# EAGLE design SchematicTwoTone (EAGLE 9.6.0)
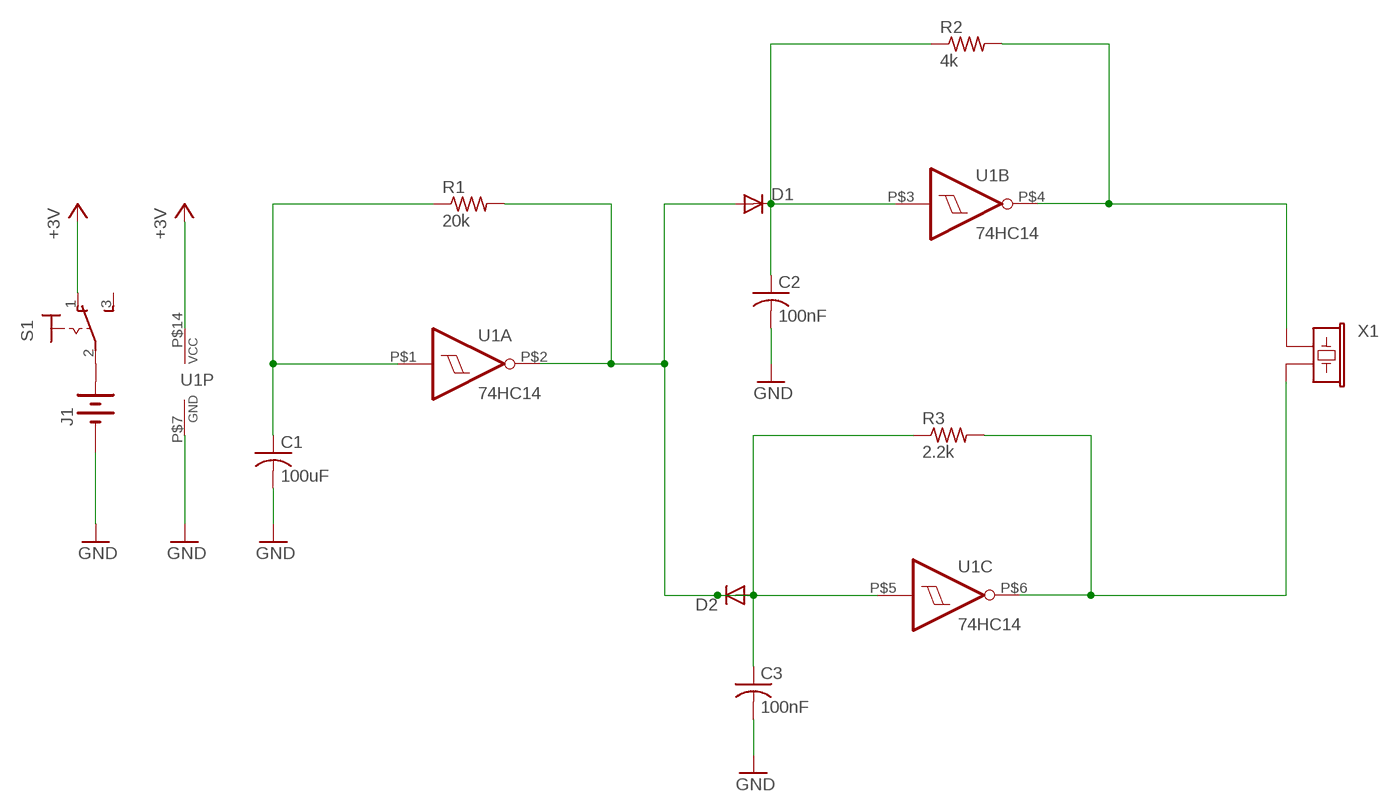
[diagram p0: schematic, sheet 1]

## Parts
C1  100uF  CAP-POLRB-D5.0XP2.0  [CAP-RB-P2.0-D5.0]
C2  100nF  CAP-POLRB-D5.0XP2.0  [CAP-RB-P2.0-D5.0]
C3  100nF  CAP-POLRB-D5.0XP2.0  [CAP-RB-P2.0-D5.0]
D1  DIODE-DO35DO35-P10.16  [DO35-P10.16]
D2  DIODE-DO35DO35-P7.62  [DO35-P7.62]
J1  BATTERY-3VBATT  [BATT-3V]
R1  20k  RESISTOR-AXIALHORIZONTAL  [AXIAL-P10.16]
R2  4k  RESISTOR-AXIALHORIZONTAL  [AXIAL-P10.16]
R3  2.2k  RESISTOR-AXIALHORIZONTAL  [AXIAL-P10.16]
S1  SWITCH-SPDT  [SS-12]
U1  74HC14  [DIP-14]
X1  BUZZER-PIEZOPS1720P02  [PS1720P02]

## Nets
+3V: S1.1(O) U1.P$14(P:VCC)
GND: C1.P$2 C2.P$2 C3.P$2 J1.P$2(-) U1.P$7(P:GND)
N$1: C1.P$1 R1.P$1 U1.P$1(A:I)
N$2: D1.A D2.A D2.K R1.P$2 U1.P$2(A:O)
N$3: C2.P$1 D1.K R2.P$1 U1.P$3(B:I)
N$4: R2.P$2 U1.P$4(B:O) X1.P$1
N$5: C3.P$1 R3.P$1 U1.P$5(C:I)
N$6: R3.P$2 U1.P$6(C:O) X1.P$2
N$7: J1.P$1(+) S1.2(P)
Unconnected: S1.3(S) U1.P$8(D:O) U1.P$9(D:I) U1.P$10(E:O) U1.P$11(E:I) U1.P$12(F:O) U1.P$13(F:I)

## Library data of the parts
C1-C3 = EGB240:CAP-POL: Capacitor, Radial, Polarised
D1 D2 = EGB240:DIODE-DO35: Diode, Axial, DO-35
J1 = EGB240:BATTERY-3V: Battery holder, 3V, 2xAA, flying leads
R1 R2 = EGB240:RESISTOR-AXIAL: Resistor, Axial, 0.25W
R3 = EGB240:RESISTOR-AXIAL: Resistor, Axial, 0.25W; SPICEPREFIX: R
S1 = EGB240:SWITCH-SPDT: Switch, SPDT, Slide, On-On
U1 = EGB240:74HC14: Hex schmitt trigger INVERTER
X1 = EGB240:BUZZER-PIEZO

## Board
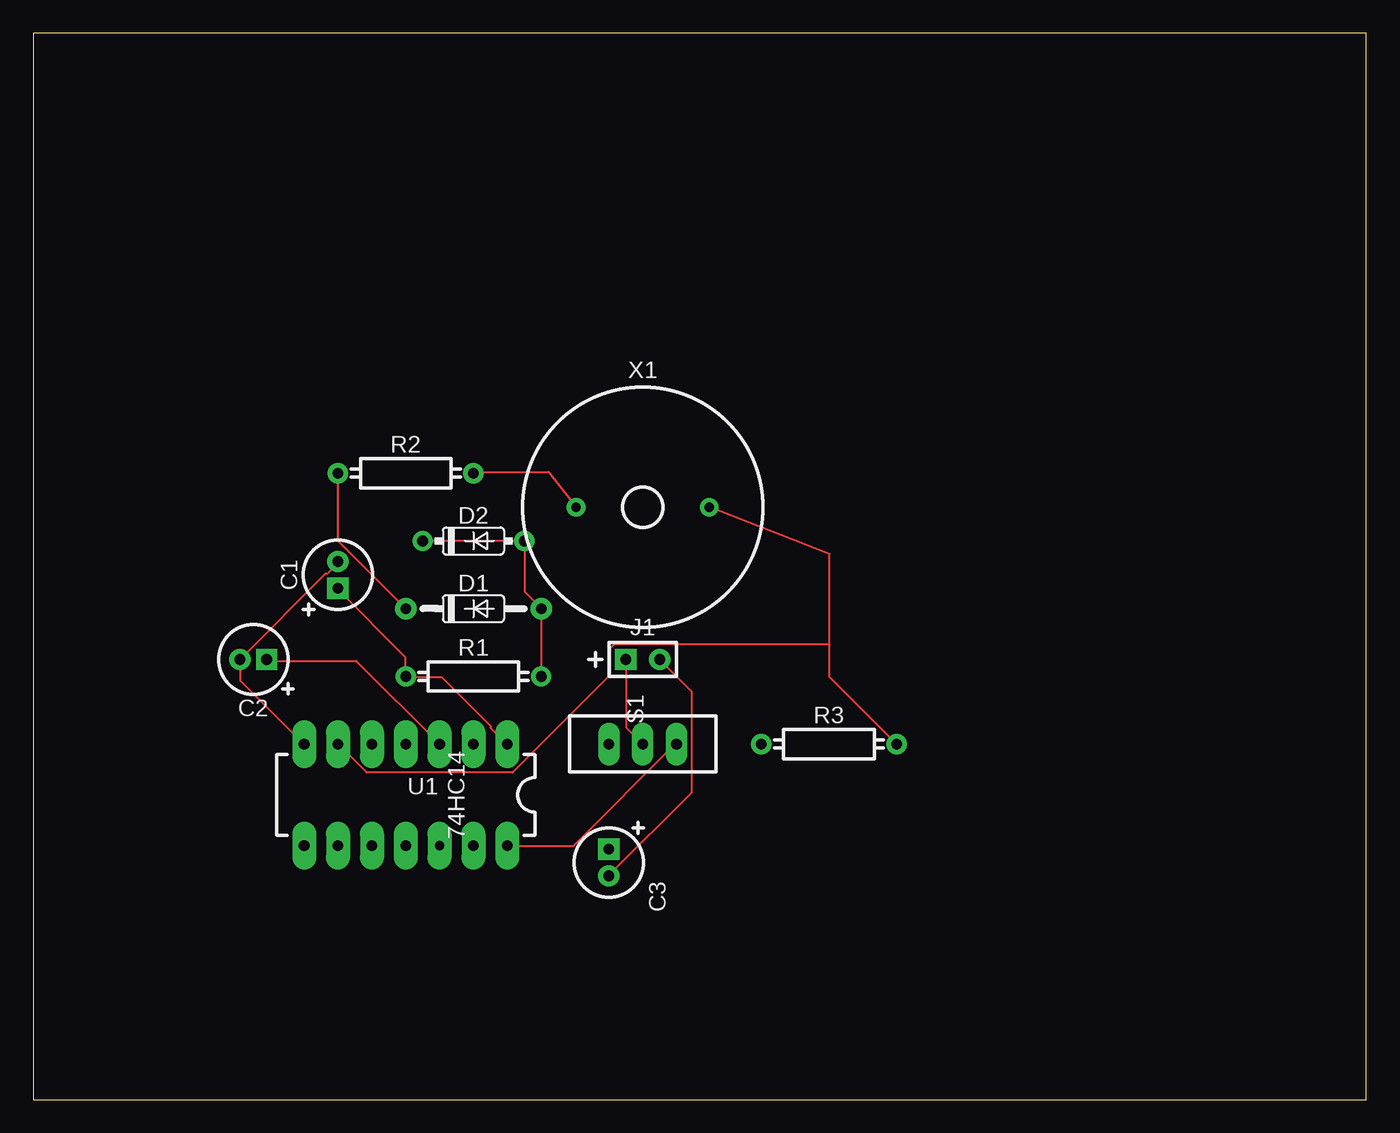
[diagram p1: board, top side]
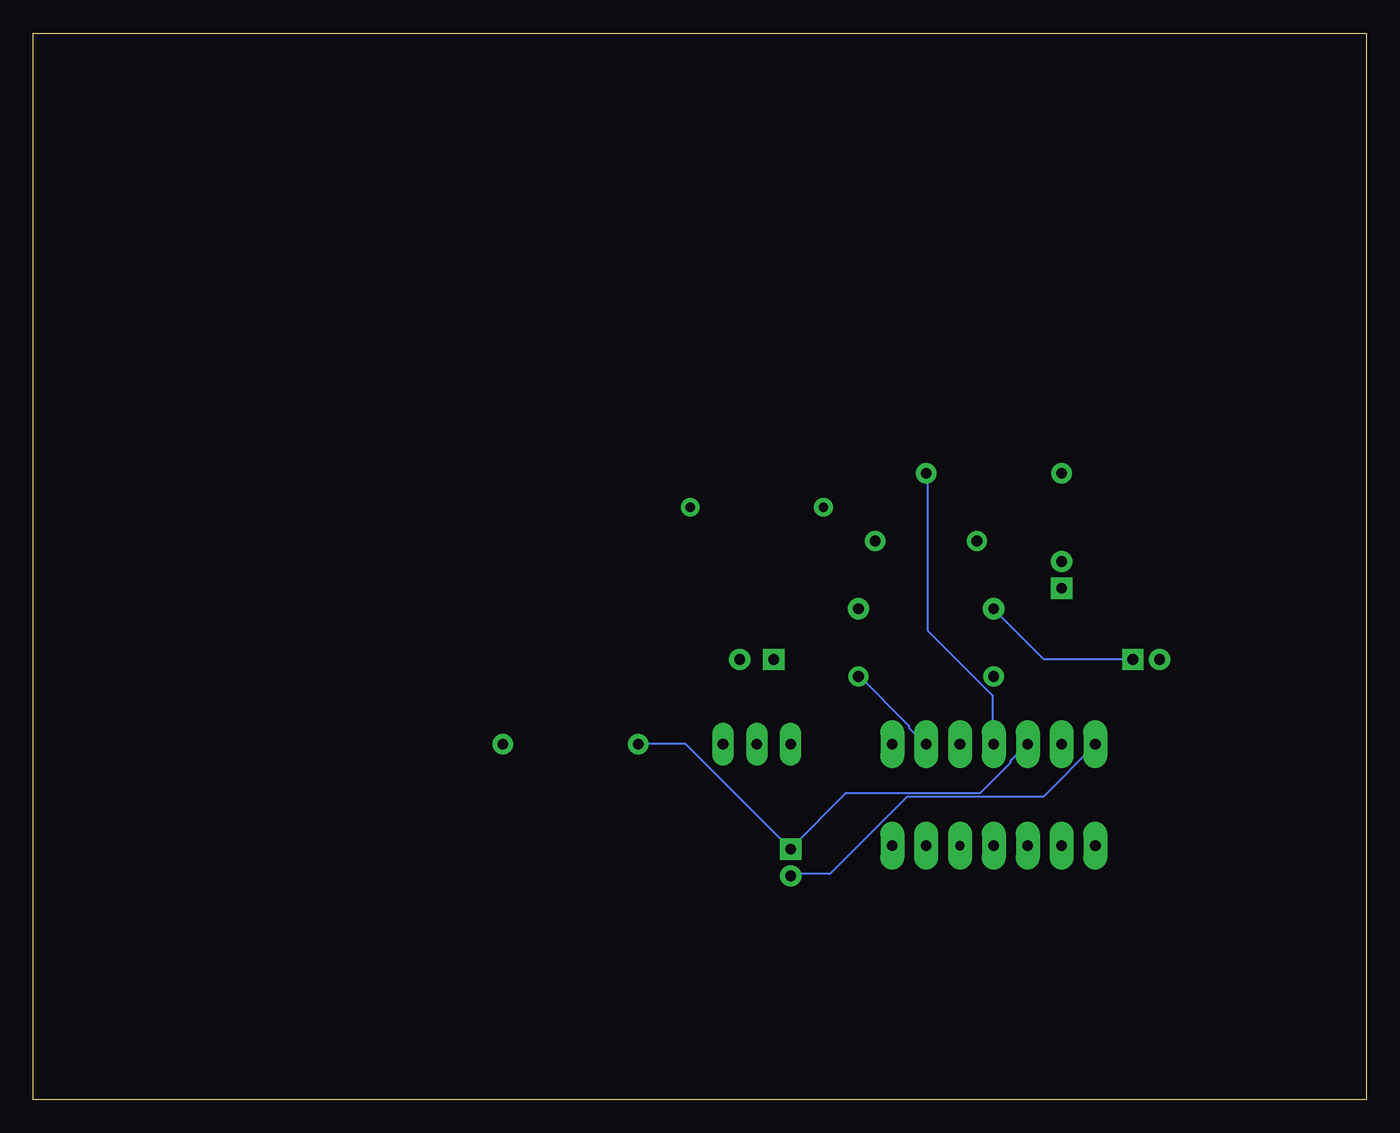
[diagram p2: board, bottom side, seen from below]

Size 100 x 80 mm. Coordinates in mm from the lower left corner, seen from the top.
Outline: 0,0 100,0 100,80 0,80 0,0
Copper layers (1*16): Top 0.035mm / dielectric 1.5mm / Bottom 0.035mm
Design rules "default": minimum track width 6mil, minimum drill 0.35mm, track to track 6mil, track to pad 6mil, pad to pad 6mil, via to via 6mil, smd to smd 6mil, copper to edge 40mil, drill to drill 6mil, minimum pad ring 10mil, minimum via ring 8mil, stop-mask expansion 4mil, vias tented up to drill 0mil, thermal gap 10mil

### Footprints (pad centres in the part's own frame; a part is rotated, then mirrored left to right if it is on the bottom)
CAP-RB-P2.0-D5.0 = drill 0.8 pad 1.6 square: P$1 -1,0 | drill 0.8 pad 1.6: P$2 1,0
DO35-P10.16 = drill 0.8 pad 1.6: A 5.08,0; K -5.08,0
DO35-P7.62 = drill 0.8 pad 1.524: A 3.81,0; K -3.81,0
BATT-3V = drill 0.8 pad 1.6 square: P$1 -1.27,0 | drill 0.8 pad 1.6: P$2 1.27,0
AXIAL-P10.16 = drill 0.8 pad 1.524: P$1 -5.08,0; P$2 5.08,0
SS-12 = drill 0.8 pad 1.6 long: 1 0,2.54; 2 0,0; 3 0,-2.54
DIP-14 = drill 0.8 pad 1.8 long: P$1 -3.81,7.62; P$2 -3.81,5.08; P$3 -3.81,2.54; P$4 -3.81,0; P$5 -3.81,-2.54; P$6 -3.81,-5.08; P$7 -3.81,-7.62; P$8 3.81,-7.62; P$9 3.81,-5.08; P$10 3.81,-2.54; P$11 3.81,0; P$13 3.81,5.08; P$14 3.81,7.62 | drill 0.7 pad 1.8 long: P$12 3.81,2.54
PS1720P02 = drill 0.7 pad 1.4: P$1 -5,0; P$2 5,0

### Placement (x,y rotation side)
C1  22.86,39.37 90 top
C2  16.51,33.02 180 top
C3  43.18,17.78 270 top
D1  33.02,36.83 0 top
D2  33.02,41.91 0 top
J1  45.72,33.02 0 top
R1  33.02,31.75 0 top
R2  27.94,46.99 0 top
R3  59.69,26.67 0 top
S1  45.72,26.67 270 top
U1  27.94,22.86 270 top
X1  45.72,44.45 0 top

### Tracks (layer width: path | path; a pad name or v marks a point on that pad's centre or on a via)
+3V
  Top 0.152: U1.P$14 40.54,19.05 48.16,26.67 S1.1
GND
  Top 0.152: J1.P$2 49.38,30.63 49.38,23.01 43.28,16.92 C3.P$2 | U1.P$7 20.27,26.67 15.54,31.39 15.54,32.92 C2.P$2 15.54,33.07 21.95,39.47 22.1,39.47 22.86,40.23 C1.P$2
  Bottom 0.152: C3.P$2 43.13,16.92 40.23,16.92 34.44,22.71 24.23,22.71 20.27,26.67 U1.P$7
N$1
  Top 0.152: C1.P$1 22.86,38.25 27.89,33.22 27.89,31.85 R1.P$1 28.04,31.7 30.63,31.7 34.29,28.04 34.29,27.89 35.51,26.67 U1.P$1
N$2
  Top 0.152: D2.K D2.A 36.88,41.91 36.88,38.1 38.1,36.88 D1.A R1.P$2
  Bottom 0.152: U1.P$2 33.07,26.67 34.29,27.89 34.29,28.04 38.1,31.85 R1.P$2
N$3
  Top 0.152: R2.P$1 22.86,41.91 D1.K | U1.P$3 24.23,32.92 17.53,32.92 C2.P$1
  Bottom 0.152: C2.P$1 17.53,33.07 24.23,33.07 27.89,36.73 D1.K
N$4
  Top 0.152: X1.P$1 38.64,47.09 33.07,47.09 R2.P$2
  Bottom 0.152: U1.P$4 28.04,26.67 28.04,30.33 32.92,35.2 32.92,46.94 R2.P$2
N$5
  Bottom 0.152: R3.P$1 51.05,26.67 43.28,18.9 C3.P$1 43.13,18.9 39.01,23.01 28.96,23.01 26.67,25.3 26.67,25.45 25.45,26.67 U1.P$5
N$6
  Top 0.152: 59.74,34.14 59.74,31.7 R3.P$2 | 59.74,34.14 59.74,40.95 X1.P$2 | U1.P$6 24.99,24.54 35.97,24.54 43.28,31.85 43.28,33.83 43.59,34.14 59.74,34.14
N$7
  Top 0.152: S1.2 44.5,27.89 44.5,32.92 J1.P$1